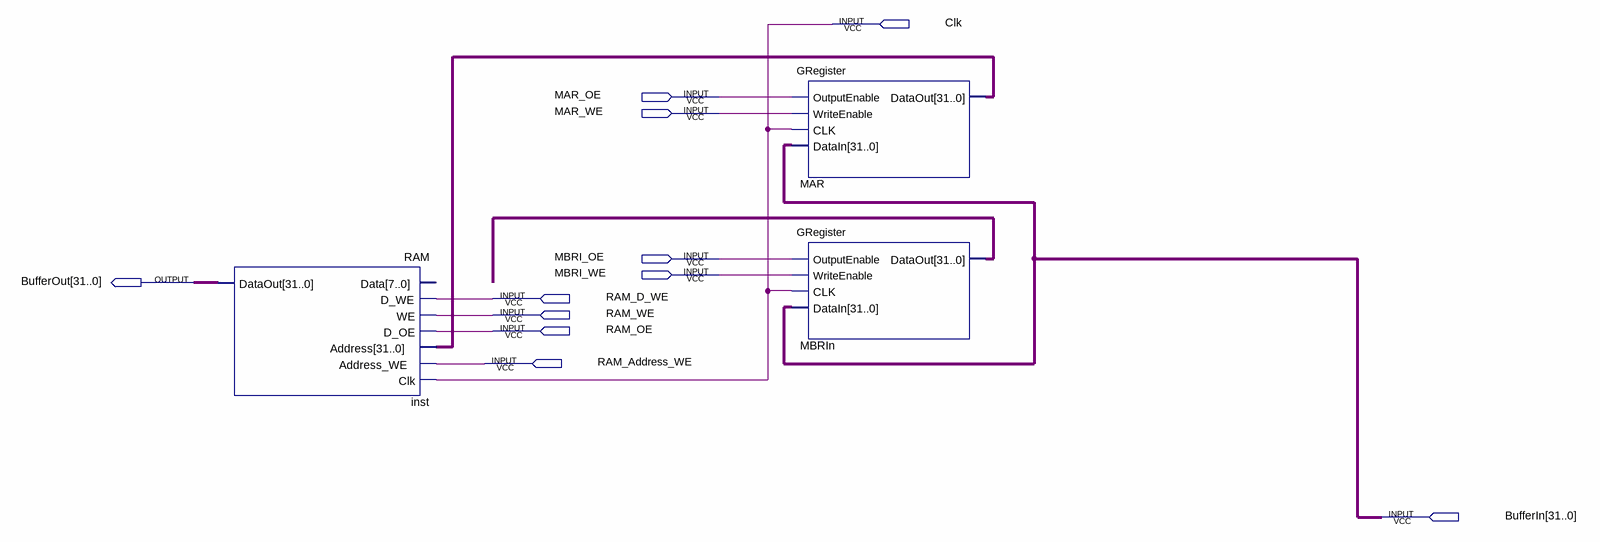
[diagram p0: schematic sheet]
// Quartus schematic RAM_Controller.bdf as structural Verilog: 3 symbols, 11 pins
module RAM_Controller (
  input  Clk,
  input  MAR_OE,
  input  MAR_WE,
  input  MBRI_OE,
  input  MBRI_WE,
  input  RAM_D_WE,
  input  RAM_WE,
  input  RAM_OE,
  input  RAM_Address_WE,
  input  [31:0] BufferIn,
  output [31:0] BufferOut
);

  wire [31:0] MAR_dataout, MBRIn_dataout;

  RAM inst (
    .D_WE(RAM_D_WE), .WE(RAM_WE), .D_OE(RAM_OE), .Address(MAR_dataout), .Address_WE(RAM_Address_WE),
    .Clk(Clk), .DataOut(BufferOut));  // open: Data
  GRegister MAR (.OutputEnable(MAR_OE), .WriteEnable(MAR_WE), .CLK(Clk), .DataIn(BufferIn), .DataOut(MAR_dataout));
  GRegister MBRIn (
    .OutputEnable(MBRI_OE), .WriteEnable(MBRI_WE), .CLK(Clk), .DataIn(BufferIn), .DataOut(MBRIn_dataout));
endmodule
